# Altium schematic sheet Config_IO.SCHDOC
size 297 x 209 mm; SheetNumber: 3; SheetTotal: 5; DocumentName: Config_IO.SCHDOC
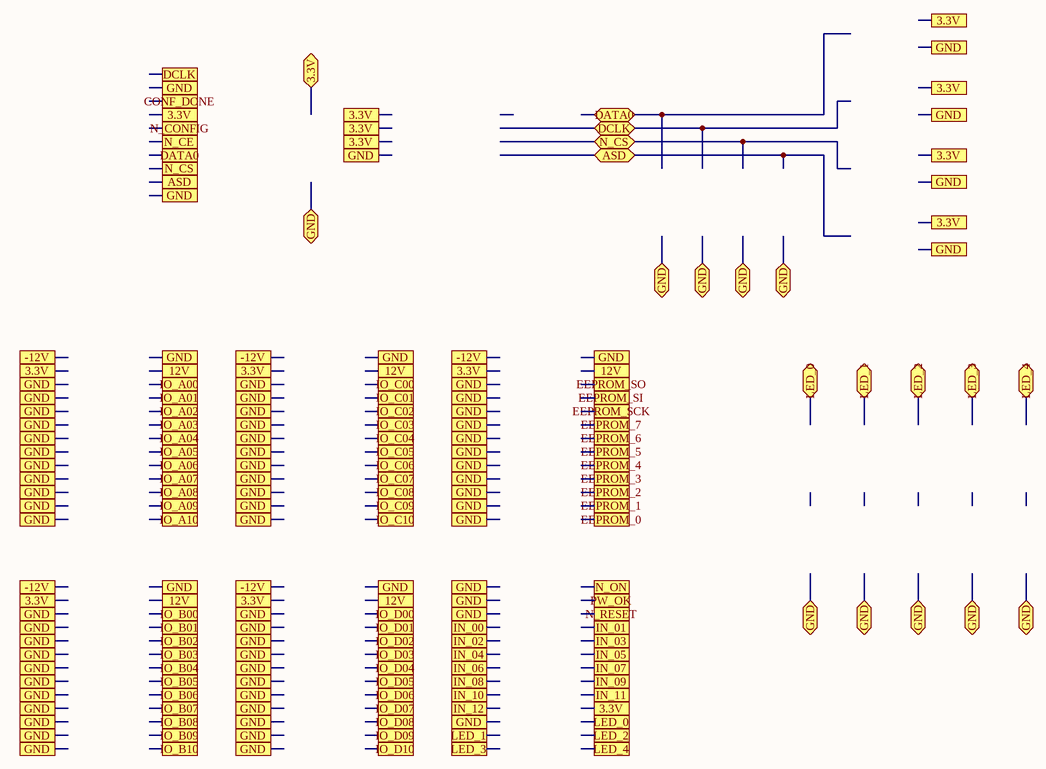
[diagram p0: Config_IO.SCHDOC]

## Ports
3.3V, 12V, -12V, ASD, ASD (bidir), CONF_DONE, DATA0, DATA0 (bidir), DCLK, DCLK (bidir), EEPROM_0, EEPROM_1, EEPROM_2, EEPROM_3, EEPROM_4, EEPROM_5, EEPROM_6, EEPROM_7, EEPROM_SCK, EEPROM_SI, EEPROM_SO, GND, IN_00, IN_01, IN_02, IN_03, IN_04, IN_05, IN_06, IN_07, IN_08, IN_09, IN_10, IN_11, IN_12, IO_A00, IO_A01, IO_A02, IO_A03, IO_A04, IO_A05, IO_A06, IO_A07, IO_A08, IO_A09, IO_A10, IO_B00, IO_B01, IO_B02, IO_B03, IO_B04, IO_B05, IO_B06, IO_B07, IO_B08, IO_B09, IO_B10, IO_C00, IO_C01, IO_C02, IO_C03, IO_C04, IO_C05, IO_C06, IO_C07, IO_C08, IO_C09, IO_C10, IO_D00, IO_D01, IO_D02, IO_D03, IO_D04, IO_D05, IO_D06, IO_D07, IO_D08, IO_D09, IO_D10, LED_0, LED_1, LED_2, LED_3, LED_4, N_CE, N_CONFIG, N_CS, N_CS (bidir), N_ON, N_RESET, PW_OK

## Notes on the sheet
- A
- B
- C
- D
- 1
- 2
- 3
- Title
- 4
- Size
- A4
- Number
- Rev
- Date
- Filename
- Drawn by
- Sheet
- of